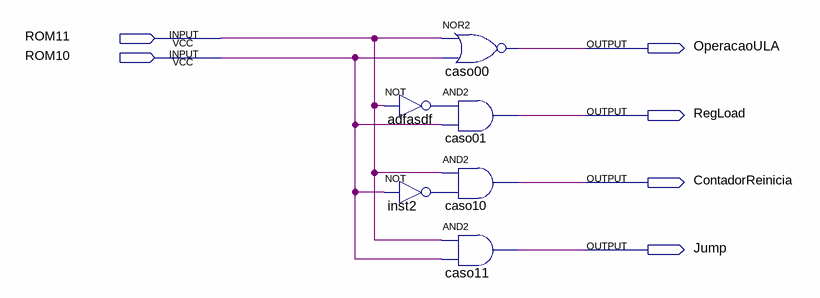
[diagram p0: schematic sheet]
// Quartus schematic UC.bdf as structural Verilog: 6 symbols, 6 pins
module UC (
  input  ROM11,
  input  ROM10,
  output OperacaoULA,
  output RegLoad,
  output ContadorReinicia,
  output Jump
);

  wire adfasdf_out, inst2_out;

  not adfasdf (adfasdf_out, ROM11);
  not inst2 (inst2_out, ROM10);
  nor caso00 (OperacaoULA, ROM11, ROM10);
  and caso01 (RegLoad, adfasdf_out, ROM10);
  and caso10 (ContadorReinicia, ROM11, inst2_out);
  and caso11 (Jump, ROM11, ROM10);
endmodule
